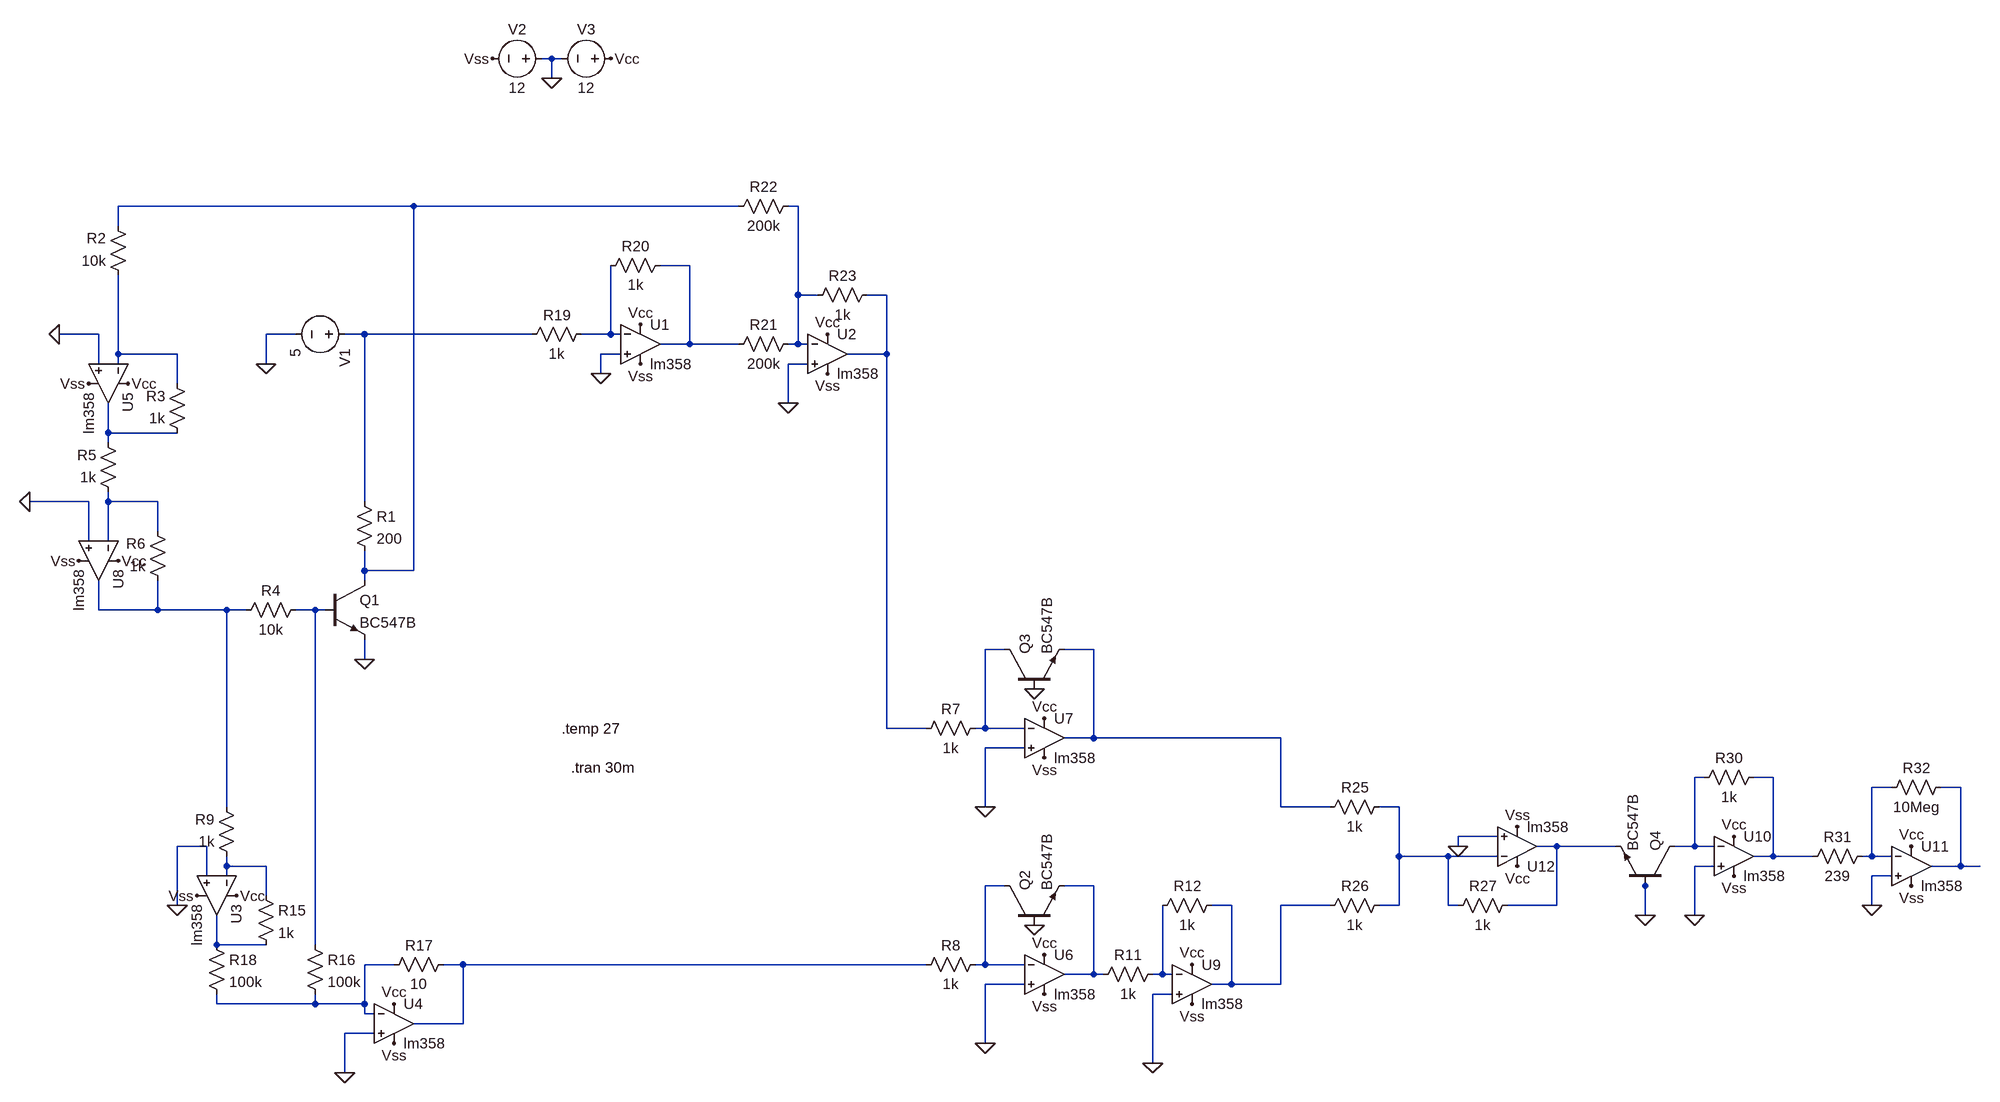
[diagram p0: schematic betafinder.asc]
betafinder.asc, the LTspice schematic file:
Version 4
SHEET 1 4264 1472
WIRE 480 -656 464 -656
WIRE 496 -656 480 -656
WIRE 480 -624 480 -656
WIRE 256 -416 -224 -416
WIRE 784 -416 256 -416
WIRE 880 -416 864 -416
WIRE -224 -384 -224 -416
WIRE 704 -320 656 -320
WIRE 880 -272 880 -416
WIRE 912 -272 880 -272
WIRE 1024 -272 992 -272
WIRE -256 -208 -320 -208
WIRE 64 -208 16 -208
WIRE 176 -208 144 -208
WIRE 448 -208 176 -208
WIRE 576 -208 576 -320
WIRE 576 -208 528 -208
WIRE 592 -208 576 -208
WIRE 704 -192 704 -320
WIRE 704 -192 656 -192
WIRE 784 -192 704 -192
WIRE 880 -192 880 -272
WIRE 880 -192 864 -192
WIRE 896 -192 880 -192
WIRE -224 -176 -224 -304
WIRE -128 -176 -224 -176
WIRE 592 -176 560 -176
WIRE 1024 -176 1024 -272
WIRE 1024 -176 960 -176
WIRE -256 -160 -256 -208
WIRE -224 -160 -224 -176
WIRE 16 -160 16 -208
WIRE 896 -160 864 -160
WIRE 560 -144 560 -176
WIRE -128 -128 -128 -176
WIRE 864 -96 864 -160
WIRE -240 -48 -240 -96
WIRE -128 -48 -240 -48
WIRE -240 -32 -240 -48
WIRE -272 64 -368 64
WIRE -240 64 -240 48
WIRE -160 64 -240 64
WIRE 176 64 176 -208
WIRE -160 112 -160 64
WIRE -272 128 -272 64
WIRE -240 128 -240 64
WIRE 176 176 176 144
WIRE 256 176 256 -416
WIRE 256 176 176 176
WIRE 176 192 176 176
WIRE -256 240 -256 192
WIRE -160 240 -160 192
WIRE -160 240 -256 240
WIRE -48 240 -160 240
WIRE -16 240 -48 240
WIRE 96 240 64 240
WIRE 112 240 96 240
WIRE 1216 304 1184 304
WIRE 1360 304 1312 304
WIRE 176 320 176 288
WIRE 1024 432 1024 -176
WIRE 1088 432 1024 432
WIRE 1184 432 1184 304
WIRE 1184 432 1168 432
WIRE 1248 432 1184 432
WIRE 1360 448 1360 304
WIRE 1360 448 1312 448
WIRE 1664 448 1360 448
WIRE 1248 464 1184 464
WIRE 2352 512 2336 512
WIRE 2464 512 2432 512
WIRE 2656 528 2624 528
WIRE 2768 528 2736 528
WIRE -48 560 -48 240
WIRE 1184 560 1184 464
WIRE 1664 560 1664 448
WIRE 1744 560 1664 560
WIRE 1856 560 1824 560
WIRE 2016 608 1952 608
WIRE -80 624 -128 624
WIRE 1952 624 1952 608
WIRE 2112 624 2080 624
WIRE 2208 624 2112 624
WIRE 2336 624 2336 512
WIRE 2336 624 2304 624
WIRE 2368 624 2336 624
WIRE 1856 640 1856 560
WIRE 1936 640 1856 640
WIRE 2016 640 1936 640
WIRE 2464 640 2464 512
WIRE 2464 640 2432 640
WIRE 2528 640 2464 640
WIRE 2624 640 2624 528
WIRE 2624 640 2608 640
WIRE 2656 640 2624 640
WIRE -48 656 -48 640
WIRE 16 656 -48 656
WIRE 2368 656 2336 656
WIRE 2768 656 2768 528
WIRE 2768 656 2720 656
WIRE 2800 656 2768 656
WIRE -80 672 -80 624
WIRE -48 672 -48 656
WIRE 2656 672 2624 672
WIRE 1216 688 1184 688
WIRE 1360 688 1312 688
WIRE 2256 688 2256 672
WIRE 16 704 16 656
WIRE -128 720 -128 624
WIRE 1584 720 1552 720
WIRE 1744 720 1664 720
WIRE 1856 720 1856 640
WIRE 1856 720 1824 720
WIRE 1936 720 1936 640
WIRE 1952 720 1936 720
WIRE 2112 720 2112 624
WIRE 2112 720 2032 720
WIRE 2624 720 2624 672
WIRE 2256 736 2256 688
WIRE 2336 736 2336 656
WIRE -64 784 -64 736
WIRE 16 784 -64 784
WIRE 96 784 96 240
WIRE 224 816 176 816
WIRE 336 816 304 816
WIRE 1088 816 336 816
WIRE 1184 816 1184 688
WIRE 1184 816 1168 816
WIRE 1248 816 1184 816
WIRE 1360 832 1360 688
WIRE 1360 832 1312 832
WIRE 1376 832 1360 832
WIRE 1472 832 1472 720
WIRE 1472 832 1456 832
WIRE 1488 832 1472 832
WIRE 1248 848 1184 848
WIRE 1584 848 1584 720
WIRE 1584 848 1552 848
WIRE 1664 848 1664 720
WIRE 1664 848 1584 848
WIRE 1488 864 1456 864
WIRE -64 880 -64 864
WIRE 96 880 96 864
WIRE 96 880 -64 880
WIRE 176 880 176 816
WIRE 176 880 96 880
WIRE 176 896 176 880
WIRE 192 896 176 896
WIRE 336 912 336 816
WIRE 336 912 256 912
WIRE 192 928 144 928
WIRE 1184 944 1184 848
WIRE 1456 976 1456 864
WIRE 144 992 144 928
FLAG -320 -208 0
FLAG 176 320 0
FLAG 16 -160 0
FLAG -368 64 0
FLAG -128 720 0
FLAG 560 -144 0
FLAG 864 -96 0
FLAG 1184 560 0
FLAG 1264 368 0
FLAG 1184 944 0
FLAG 1264 752 0
FLAG 1456 976 0
FLAG 1952 624 0
FLAG 2256 736 0
FLAG 2336 736 0
FLAG 144 992 0
FLAG 2624 720 0
FLAG 480 -624 0
FLAG 576 -656 Vcc
FLAG 928 -208 Vcc
FLAG 624 -224 Vcc
FLAG -208 -128 Vcc
FLAG -224 160 Vcc
FLAG -32 704 Vcc
FLAG 224 880 Vcc
FLAG 1280 416 Vcc
FLAG 1280 800 Vcc
FLAG 1520 816 Vcc
FLAG 2048 656 Vcc
FLAG 2400 608 Vcc
FLAG 2688 624 Vcc
FLAG 384 -656 Vss
FLAG 624 -160 Vss
FLAG 928 -144 Vss
FLAG -272 -128 Vss
FLAG -288 160 Vss
FLAG -96 704 Vss
FLAG 224 944 Vss
FLAG 1280 864 Vss
FLAG 1280 480 Vss
FLAG 1520 880 Vss
FLAG 2048 592 Vss
FLAG 2400 672 Vss
FLAG 2688 688 Vss
SYMBOL npn 112 192 R0
SYMATTR InstName Q1
SYMATTR Value BC547B
SYMBOL res 160 48 R0
SYMATTR InstName R1
SYMATTR Value 200
SYMBOL voltage 160 -208 R90
WINDOW 123 0 0 Left 0
WINDOW 39 0 0 Left 0
SYMATTR InstName V1
SYMATTR Value 5
SYMBOL res -208 -288 R180
WINDOW 0 36 76 Left 2
WINDOW 3 36 40 Left 2
SYMATTR InstName R2
SYMATTR Value 10k
SYMBOL res -112 -32 R180
WINDOW 0 36 76 Left 2
WINDOW 3 36 40 Left 2
SYMATTR InstName R3
SYMATTR Value 1k
SYMBOL res 80 224 R90
WINDOW 0 0 56 VBottom 2
WINDOW 3 32 56 VTop 2
SYMATTR InstName R4
SYMATTR Value 10k
SYMBOL res -224 64 R180
WINDOW 0 36 76 Left 2
WINDOW 3 36 40 Left 2
SYMATTR InstName R5
SYMATTR Value 1k
SYMBOL res -144 208 R180
WINDOW 0 36 76 Left 2
WINDOW 3 36 40 Left 2
SYMATTR InstName R6
SYMATTR Value 1k
SYMBOL res 0 688 R0
SYMATTR InstName R15
SYMATTR Value 1k
SYMBOL res 208 832 R270
WINDOW 0 32 56 VTop 2
WINDOW 3 0 56 VBottom 2
SYMATTR InstName R17
SYMATTR Value 10
SYMBOL res -80 768 R0
SYMATTR InstName R18
SYMATTR Value 100k
SYMBOL res 80 768 R0
SYMATTR InstName R16
SYMATTR Value 100k
SYMBOL res 544 -224 R90
WINDOW 0 0 56 VBottom 2
WINDOW 3 32 56 VTop 2
SYMATTR InstName R19
SYMATTR Value 1k
SYMBOL res 672 -336 R90
WINDOW 0 0 56 VBottom 2
WINDOW 3 32 56 VTop 2
SYMATTR InstName R20
SYMATTR Value 1k
SYMBOL res 880 -208 R90
WINDOW 0 0 56 VBottom 2
WINDOW 3 32 56 VTop 2
SYMATTR InstName R21
SYMATTR Value 200k
SYMBOL res 880 -432 R90
WINDOW 0 0 56 VBottom 2
WINDOW 3 32 56 VTop 2
SYMATTR InstName R22
SYMATTR Value 200k
SYMBOL res 1008 -288 R90
WINDOW 0 0 56 VBottom 2
WINDOW 3 32 56 VTop 2
SYMATTR InstName R23
SYMATTR Value 1k
SYMBOL res 1184 416 R90
WINDOW 0 0 56 VBottom 2
WINDOW 3 32 56 VTop 2
SYMATTR InstName R7
SYMATTR Value 1k
SYMBOL npn 1216 368 R270
SYMATTR InstName Q3
SYMATTR Value BC547B
SYMBOL res 1184 800 R90
WINDOW 0 0 56 VBottom 2
WINDOW 3 32 56 VTop 2
SYMATTR InstName R8
SYMATTR Value 1k
SYMBOL npn 1216 752 R270
SYMATTR InstName Q2
SYMATTR Value BC547B
SYMBOL res 1472 816 R90
WINDOW 0 0 56 VBottom 2
WINDOW 3 32 56 VTop 2
SYMATTR InstName R11
SYMATTR Value 1k
SYMBOL res 1568 704 R90
WINDOW 0 0 56 VBottom 2
WINDOW 3 32 56 VTop 2
SYMATTR InstName R12
SYMATTR Value 1k
SYMBOL res 1840 544 R90
WINDOW 0 0 56 VBottom 2
WINDOW 3 32 56 VTop 2
SYMATTR InstName R25
SYMATTR Value 1k
SYMBOL res 1840 704 R90
WINDOW 0 0 56 VBottom 2
WINDOW 3 32 56 VTop 2
SYMATTR InstName R26
SYMATTR Value 1k
SYMBOL res 2048 704 R90
WINDOW 0 0 56 VBottom 2
WINDOW 3 32 56 VTop 2
SYMATTR InstName R27
SYMATTR Value 1k
SYMBOL npn 2304 688 M270
SYMATTR InstName Q4
SYMATTR Value BC547B
SYMBOL res 2448 496 R90
WINDOW 0 0 56 VBottom 2
WINDOW 3 32 56 VTop 2
SYMATTR InstName R30
SYMATTR Value 1k
SYMBOL res 2624 624 R90
WINDOW 0 0 56 VBottom 2
WINDOW 3 32 56 VTop 2
SYMATTR InstName R31
SYMATTR Value 239
SYMBOL res 2752 512 R90
WINDOW 0 0 56 VBottom 2
WINDOW 3 32 56 VTop 2
SYMATTR InstName R32
SYMATTR Value 10Meg
SYMBOL res -32 656 R180
WINDOW 0 36 76 Left 2
WINDOW 3 36 40 Left 2
SYMATTR InstName R9
SYMATTR Value 1k
SYMBOL voltage 480 -656 R90
WINDOW 0 -32 56 VBottom 2
WINDOW 3 32 56 VTop 2
WINDOW 123 0 0 Left 0
WINDOW 39 0 0 Left 0
SYMATTR InstName V2
SYMATTR Value 12
SYMBOL voltage 592 -656 R90
WINDOW 0 -32 56 VBottom 2
WINDOW 3 32 56 VTop 2
WINDOW 123 0 0 Left 0
WINDOW 39 0 0 Left 0
SYMATTR InstName V3
SYMATTR Value 12
SYMBOL OpAmps\\lm358 624 -256 R0
SYMATTR InstName U1
SYMBOL OpAmps\\lm358 928 -240 R0
SYMATTR InstName U2
SYMBOL OpAmps\\lm358 -176 -128 R90
SYMATTR InstName U5
SYMBOL OpAmps\\lm358 -192 160 R90
SYMATTR InstName U8
SYMBOL OpAmps\\lm358 0 704 R90
SYMATTR InstName U3
SYMBOL OpAmps\\lm358 224 848 R0
SYMATTR InstName U4
SYMBOL OpAmps\\lm358 1280 768 R0
SYMATTR InstName U6
SYMBOL OpAmps\\lm358 1280 384 R0
SYMATTR InstName U7
SYMBOL OpAmps\\lm358 1520 784 R0
SYMATTR InstName U9
SYMBOL OpAmps\\lm358 2400 576 R0
SYMATTR InstName U10
SYMBOL OpAmps\\lm358 2688 592 R0
SYMATTR InstName U11
SYMBOL OpAmps\\lm358 2048 688 M180
SYMATTR InstName U12
TEXT 512 496 Left 2 !.tran 30m
TEXT 496 432 Left 2 !.temp 27

The netlist it stands for:
* betafinder.asc
Q1 N001 N011 0 0 BC547B
R1 N005 N001 200
V1 N005 0 5
R2 N007 N001 10k
R3 N008 N007 1k
R4 N011 N010 10k
R5 N009 N008 1k
R6 N010 N009 1k
R15 N020 N024 1k
R17 N025 N026 10
R18 N024 N025 100k
R16 N011 N025 100k
R19 N006 N005 1k
R20 N003 N006 1k
R21 N002 N003 200k
R22 N002 N001 200k
R23 N004 N002 1k
R7 N012 N004 1k
Q3 N012 0 N013 0 BC547B
R8 N021 N026 1k
Q2 N021 0 N022 0 BC547B
R11 N027 N022 1k
R12 N023 N027 1k
R25 N018 N013 1k
R26 N018 N023 1k
R27 N019 N018 1k
Q4 N014 0 N019 0 BC547B
R30 N015 N014 1k
R31 N016 N015 239
R32 N017 N016 10Meg
R9 N020 N010 1k
V2 0 Vss 12
V3 Vcc 0 12
XU1 0 N006 Vcc Vss N003 lm358  ; pins In+ In- V+ V- OUT
XU2 0 N002 Vcc Vss N004 lm358  ; pins In+ In- V+ V- OUT
XU5 0 N007 Vcc Vss N008 lm358  ; pins In+ In- V+ V- OUT
XU8 0 N009 Vcc Vss N010 lm358  ; pins In+ In- V+ V- OUT
XU3 0 N020 Vcc Vss N024 lm358  ; pins In+ In- V+ V- OUT
XU4 0 N025 Vcc Vss N026 lm358  ; pins In+ In- V+ V- OUT
XU6 0 N021 Vcc Vss N022 lm358  ; pins In+ In- V+ V- OUT
XU7 0 N012 Vcc Vss N013 lm358  ; pins In+ In- V+ V- OUT
XU9 0 N027 Vcc Vss N023 lm358  ; pins In+ In- V+ V- OUT
XU10 0 N014 Vcc Vss N015 lm358  ; pins In+ In- V+ V- OUT
XU11 0 N016 Vcc Vss N017 lm358  ; pins In+ In- V+ V- OUT
XU12 0 N018 Vcc Vss N019 lm358  ; pins In+ In- V+ V- OUT
.model NPN NPN
.model PNP PNP
.lib standard.bjt
.tran 30m
.temp 27
.backanno
.end